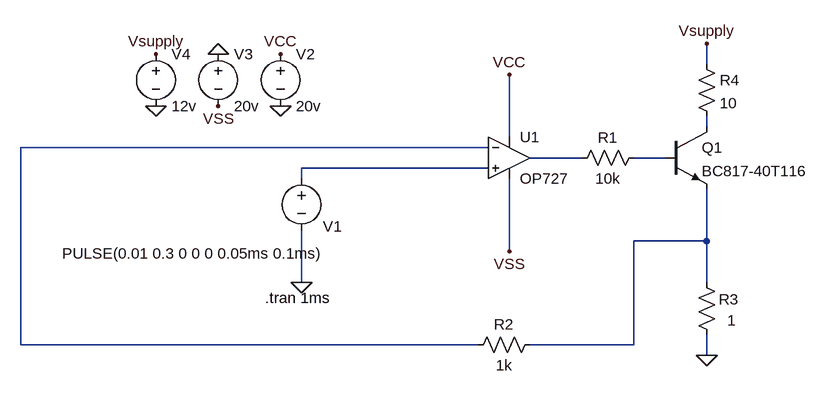
[diagram p0: schematic 6432067021-PB4.asc]
6432067021-PB4.asc, the LTspice schematic file:
Version 4
SHEET 1 880 680
WIRE 352 -32 352 -64
WIRE 352 64 352 48
WIRE 48 80 48 -16
WIRE 16 96 -704 96
WIRE 160 112 80 112
WIRE 288 112 240 112
WIRE 16 128 -272 128
WIRE -272 144 -272 128
WIRE 352 240 352 160
WIRE 352 240 240 240
WIRE 48 256 48 144
WIRE -272 304 -272 224
WIRE 352 304 352 240
WIRE -704 400 -704 96
WIRE 0 400 -704 400
WIRE 240 400 240 240
WIRE 240 400 80 400
WIRE 352 416 352 384
FLAG -272 304 0
FLAG 48 -16 VCC
FLAG -304 -48 VCC
FLAG -304 32 0
FLAG 48 256 VSS
FLAG -400 -48 0
FLAG -400 32 VSS
FLAG 352 416 0
FLAG -496 -48 Vsupply
FLAG -496 32 0
FLAG 352 -64 Vsupply
SYMBOL voltage -272 128 R0
WINDOW 123 0 0 Left 0
WINDOW 39 0 0 Left 0
WINDOW 0 33 90 Left 2
WINDOW 3 -368 131 Left 2
SYMATTR InstName V1
SYMATTR Value PULSE(0.01 0.3 0 0 0 0.05ms 0.1ms)
SYMBOL voltage -304 -64 R0
WINDOW 123 0 0 Left 0
WINDOW 39 0 0 Left 0
SYMATTR InstName V2
SYMATTR Value 20v
SYMBOL OP727 48 48 R0
SYMATTR InstName U1
SYMBOL voltage -400 -64 R0
WINDOW 123 0 0 Left 0
WINDOW 39 0 0 Left 0
SYMATTR InstName V3
SYMATTR Value 20v
SYMBOL Res 368 400 R180
WINDOW 0 -33 70 Left 2
WINDOW 3 -29 38 Left 2
SYMATTR InstName R3
SYMATTR Value 1
SYMBOL voltage -496 -64 R0
WINDOW 123 0 0 Left 0
WINDOW 39 0 0 Left 0
SYMATTR InstName V4
SYMATTR Value 12v
SYMBOL Res 256 96 R90
WINDOW 0 0 56 VBottom 2
WINDOW 3 32 56 VTop 2
SYMATTR InstName R1
SYMATTR Value 10k
SYMBOL Res 96 384 R90
WINDOW 0 0 56 VBottom 2
WINDOW 3 32 56 VTop 2
SYMATTR InstName R2
SYMATTR Value 1k
SYMBOL Res 336 -48 R0
SYMATTR InstName R4
SYMATTR Value 10
SYMBOL npn 288 64 R0
SYMATTR InstName Q1
SYMATTR Value BC817-40T116
TEXT -328 328 Left 2 !.tran 1ms

The netlist it stands for:
* 6432067021-PB4.asc
V1 N005 0 PULSE(0.01 0.3 0 0 0 0.05ms 0.1ms)
V2 VCC 0 20v
* U1: OP727 (symbol OP727 not available, pins judged from their places): In+=N005 In-=N002 V+=VCC V-=VSS OUT=N003
V3 0 VSS 20v
R3 0 N006 1
V4 Vsupply 0 12v
R1 N004 N003 10k
R2 N006 N002 1k
R4 Vsupply N001 10
Q1 N001 N004 N006 0 BC817-40T116
.model NPN NPN
.model PNP PNP
.lib standard.bjt
.tran 1ms
.backanno
.end